# EasyEDA Pro project BLDCV6-nerdyintern.eprj, board PCB3
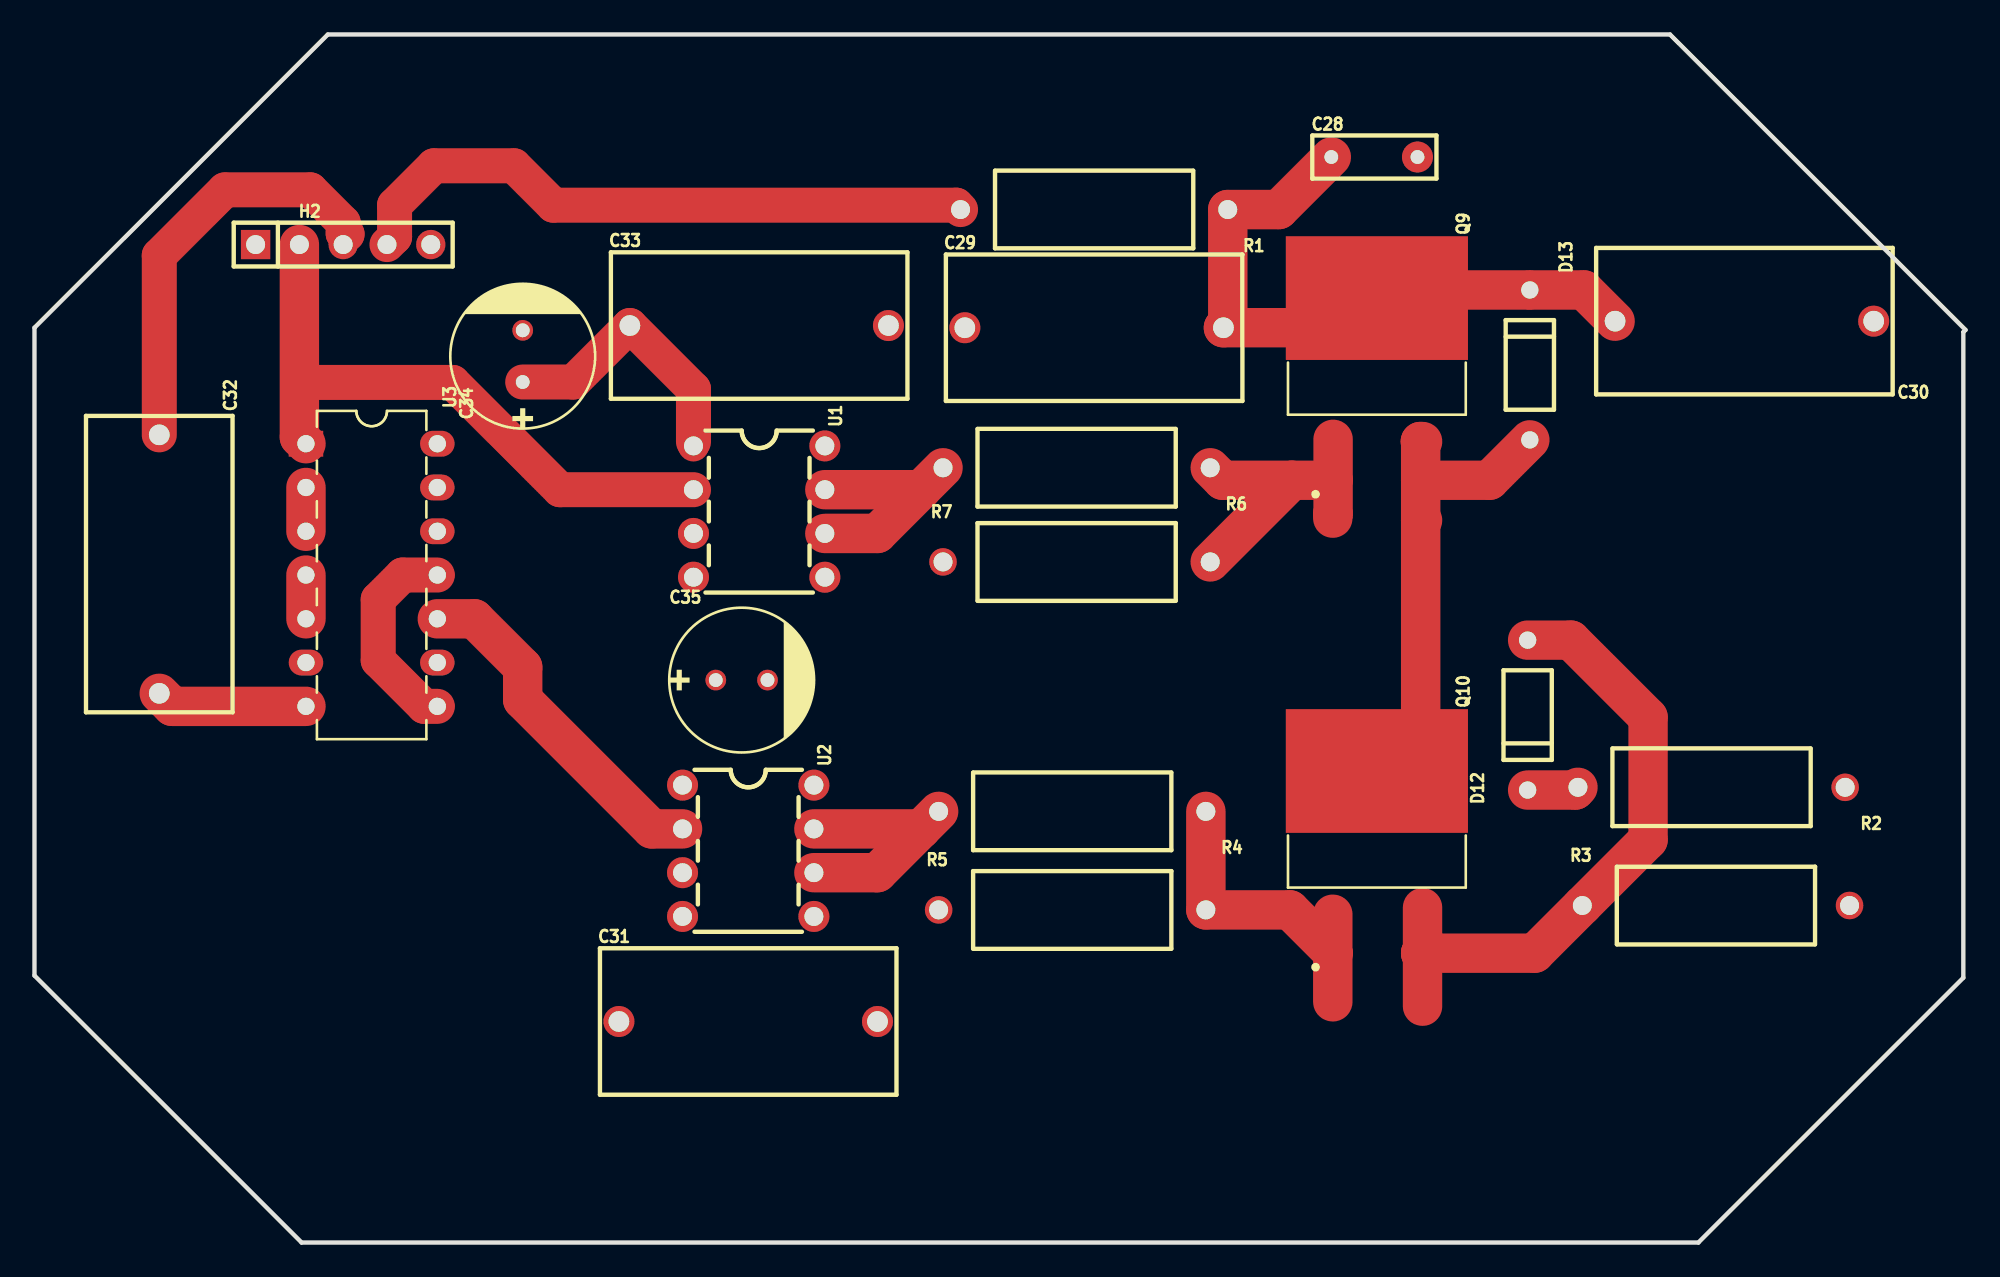
[diagram p9: board, top side]
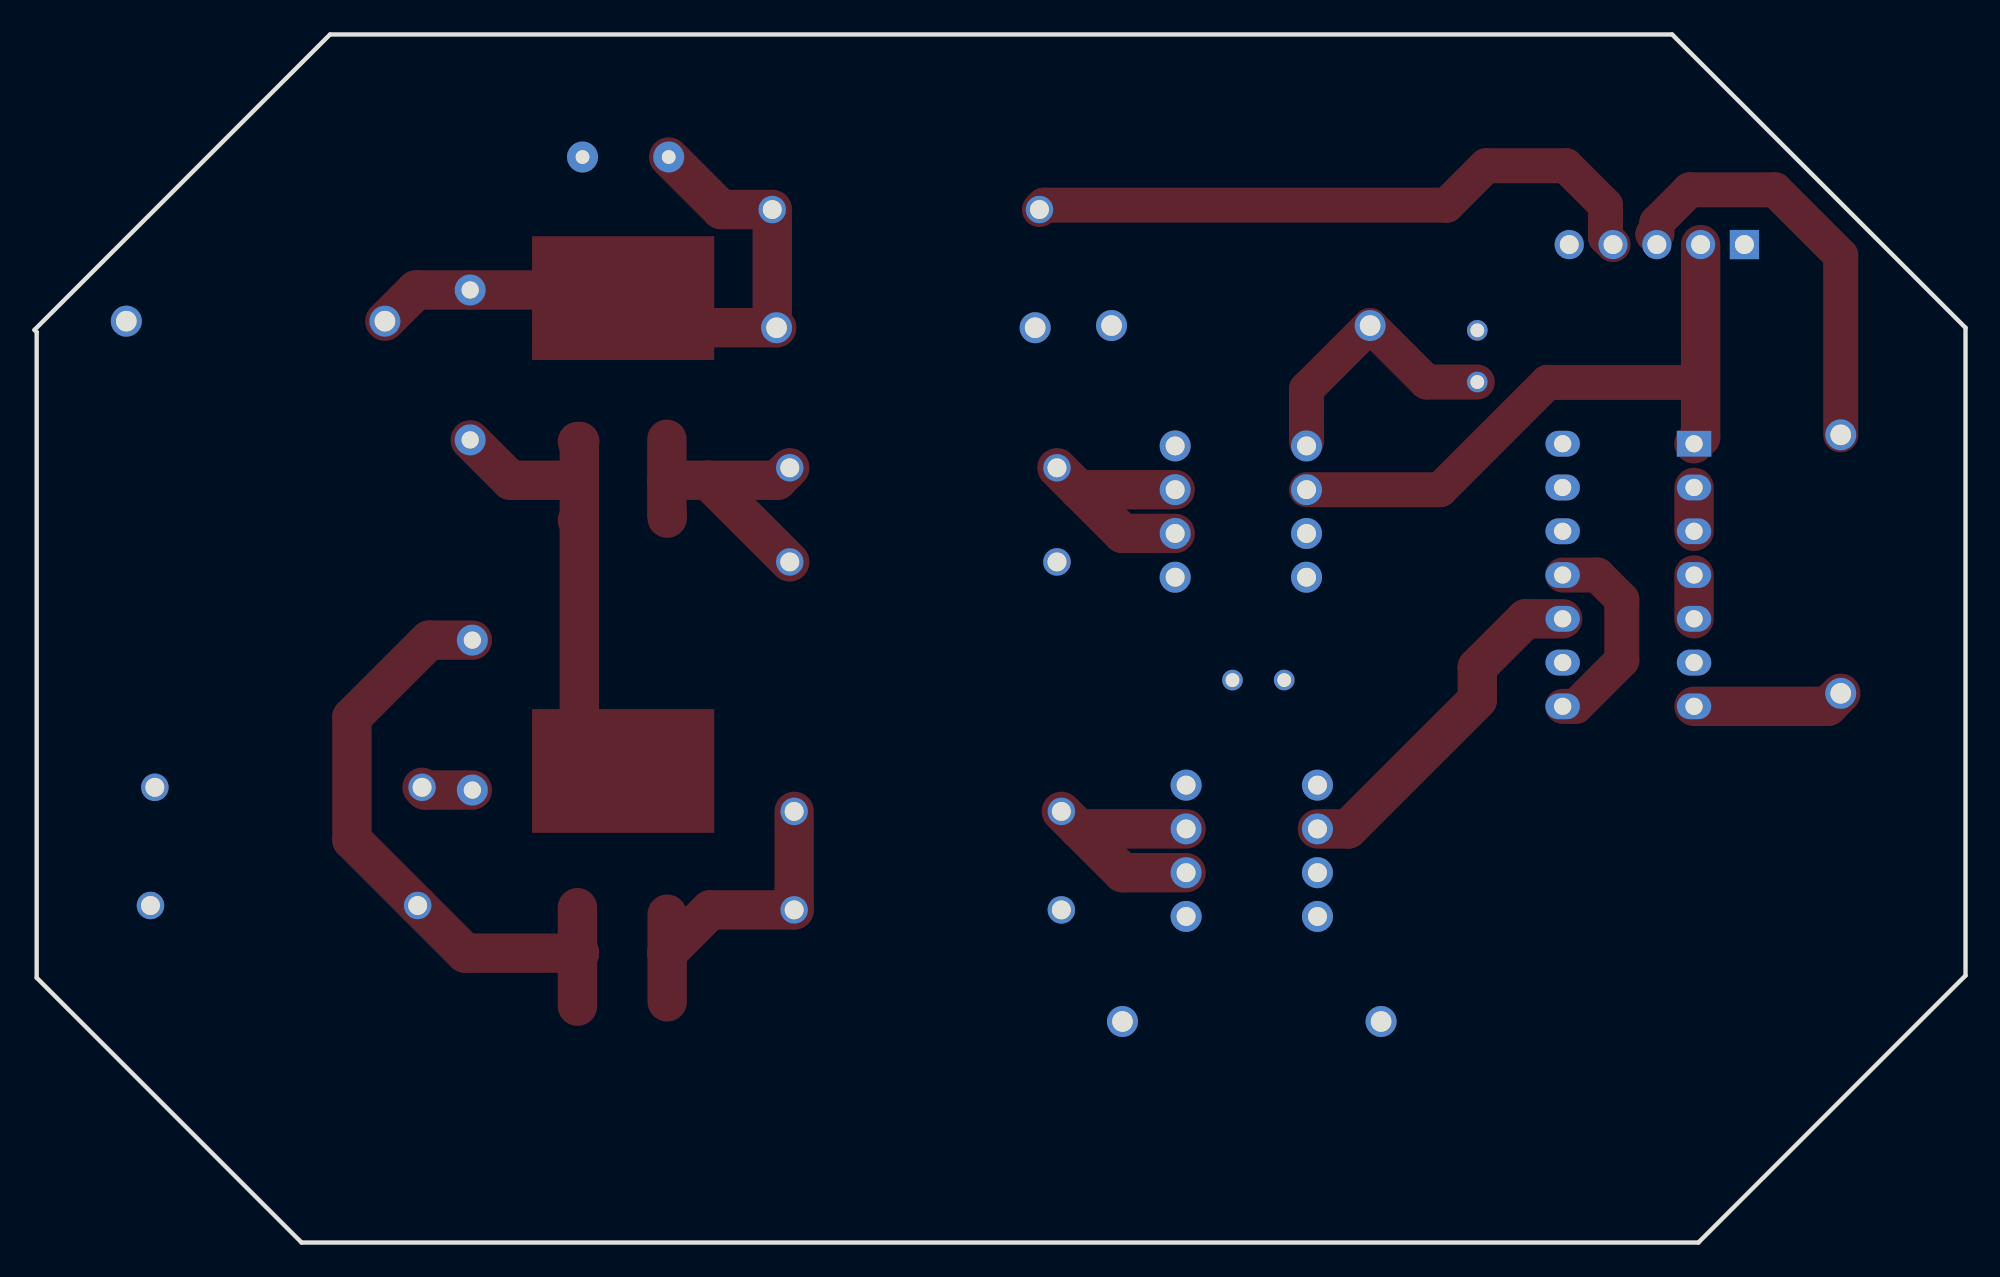
[diagram p10: board, bottom side, seen from below]

Outline 112.01 x 70.1 mm; copper layers: Top Layer, Bottom Layer. Coordinates in mm from the lower left corner of the outline.
Outline path: 0,53.09 0,15.49 15.49,0 96.52,0 111.89,15.37 111.89,52.83 112.01,52.96 94.87,70.1 17.02,70.1 0,53.09
Stack: Top Layer 0.035mm / Dielectric1 1.51mm FR4 er 4.5 / Bottom Layer 0.035mm

## Design rules (mm)
template: Custom Config
spacing copperThickness1oz (default): track to track 0.75, other pairs 0.152 to 0.3
spacing copperThickness2oz: track to track 0.203, other pairs 0.152 to 0.3
track width copperThickness1oz (default): min 0.127, default 0.254, max 2.54
track width copperThickness2oz: min 0.203, default 0.254, max 2.54
differential pair differentialPair (default): width min 0.127, default 0.254, max 2.54; gap min 0.152, default 0.152
via viaSize (default): diameter min 0.5, default 0.61, max 10; hole min 0.3, default 0.305, max 6.3

## Placement (name value [footprint] x y rotation side)
C28  1uF  [CAP-TH_L7.2-W2.5-P5.00-D0.6]  77.72 62.99 0 top
C29  1uF  [CAP-TH_L17.0-W8.5-P15.00-D0.8]  61.47 53.09 0 top
C30  1uF  [CAP-TH_L17.0-W8.5-P15.00-D0.8]  99.19 53.47 180 top
C31  1uF  [CAP-TH_L17.0-W8.5-P15.00-D0.8]  41.4 12.83 0 top
C32  1uF  [CAP-TH_L17.0-W8.5-P15.00-D0.8]  7.24 39.37 270 top
C33  1uF  [CAP-TH_L17.0-W8.5-P15.00-D0.8]  42.04 53.21 0 top
C34  15uF 450V  [CAP-TH_BD8.3-P3.00-D0.6-FD]  28.32 51.43 90 top
C35  15uF 450V  [CAP-TH_BD8.3-P3.00-D0.6-FD]  41.02 32.64 0 top
D12  -  [DO-41_BD2.4-L4.7-P8.70-D0.9-RD]  86.61 30.61 90 top
D13  -  [DO-41_BD2.4-L4.7-P8.70-D0.9-RD]  86.74 50.93 270 top
H2  -  [HDR-TH_5P-P2.54-V-M]  17.91 57.91 0 top
Q9  IRFS4010TRLPBF  [D2PAK_L9.1-W10.0-P2.54-LS15.3-BR-1]  77.87 49.52 270 top
Q10  IRFS4010TRLPBF  [D2PAK_L9.1-W10.0-P2.54-LS15.3-BR-1]  77.87 22.08 270 top
R1  10kΩ  [RES-TH_BD4.5-L11.5-P15.50-D0.8]  61.47 59.94 180 top
R2  10kΩ  [RES-TH_BD4.5-L11.5-P15.50-D0.8]  97.28 26.42 180 top
R3  10kΩ  [RES-TH_BD4.5-L11.5-P15.50-D0.8]  97.54 19.56 0 top
R4  10kΩ  [RES-TH_BD4.5-L11.5-P15.50-D0.8]  60.2 25.02 180 top
R5  10kΩ  [RES-TH_BD4.5-L11.5-P15.50-D0.8]  60.2 19.3 0 top
R6  10kΩ  [RES-TH_BD4.5-L11.5-P15.50-D0.8]  60.45 44.96 180 top
R7  10kΩ  [RES-TH_BD4.5-L11.5-P15.50-D0.8]  60.45 39.5 0 top
U1  TC4420EPA  [PDIP-8_L9.3-W6.4-P2.54-LS7.6-BL]  42.04 42.42 270 top
U2  TC4420EPA  [PDIP-8_L9.3-W6.4-P2.54-LS7.6-BL]  41.4 22.73 270 top
U3  SN74HC14N(XBLW)  [DIP-14_L19.0-W6.4-P2.54-LS7.6-BL]  19.56 38.73 270 top

## Footprints (pads in the part's own frame, mm; a bottom-side part is the same pattern mirrored in y, then rotated)
CAP-TH_BD8.3-P3.00-D0.6-FD
  round 1.202 hole 0.801: 1(-1.5,0) 2(1.5,0)
CAP-TH_L7.2-W2.5-P5.00-D0.6
  round 1.8 hole 0.8: 1(-2.499,0) 2(2.499,0)
CAP-TH_L17.0-W8.5-P15.00-D0.8
  round 1.8 hole 1.2: 1(-7.5,0) 2(7.5,0)
D2PAK_L9.1-W10.0-P2.54-LS15.3-BR-1
  rect 3.358x1.134 smd: 1(5.285,-2.54) 3(5.285,2.54)
  rect 7.181x10.566 smd: 4(-5.286,0)
DIP-14_L19.0-W6.4-P2.54-LS7.6-BL
  rect 1.5x2 hole 1: 1(-7.62,-3.81)
  oval 1.5x2 hole 1: 2(-5.08,-3.81) 3(-2.54,-3.81) 4(0,-3.81) 5(2.54,-3.81) 6(5.08,-3.81) 7(7.62,-3.81) 8(7.62,3.81) 9(5.08,3.81) 10(2.54,3.81) 11(0,3.81) 12(-2.54,3.81) 13(-5.08,3.81) 14(-7.62,3.81)
DO-41_BD2.4-L4.7-P8.70-D0.9-RD
  round 1.8 hole 1: 1(-4.35,0) 2(4.35,0)
HDR-TH_5P-P2.54-V-M
  rect 1.7x1.7 hole 1.1: 1(-5.08,0)
  round 1.7 hole 1.1: 2(-2.54,0) 3(0,0) 4(2.54,0) 5(5.08,0)
PDIP-8_L9.3-W6.4-P2.54-LS7.6-BL
  round 1.8 hole 1.1: 1(-3.81,-3.81) 2(-1.27,-3.81) 3(1.27,-3.81) 4(3.81,-3.81) 5(3.81,3.81) 6(1.27,3.81) 7(-1.27,3.81) 8(-3.81,3.81)
RES-TH_BD4.5-L11.5-P15.50-D0.8
  round 1.6 hole 1.1: 1(-7.75,0) 2(7.75,0)

## Nets
As in the schematic.

Pads without a net: U1 3; U2 3; U3 12

## Routing (per net, layer and track width the routed paths; a pad name or vN(x,y) marks a point on that pad's centre or on a via; arc(x,y) is an arc through that point)
+5V: length 24.3
  Top Layer w2.032: C32.1 7.24,57.28 11.05,61.09 16,61.09 17.91,59.18 17.91,58.55 18.13,58.52 18.14,58.51
GND: length 8.8
  Top Layer w2.286: C32.2 7.99,31.11 U3.7
VCC: length 37.3
  Top Layer w2.032: R1.2 53.46,60.2 30.1,60.2 27.81,62.48 23.17,62.48 20.89,60.2 20.89,58.35 H2.4
VCC_DRV: length 15.8
  Top Layer w2.032: C34.1 31.26,49.93 C33.1 38.23,49.52 38.23,46.47
HIN: length 37.1
  Top Layer w2.032: U1.2 30.48,43.69 24.26,49.91 16,49.91 15.62,49.53
  Top Layer w2.286: 15.37,57.91 15.37,46.74 U3.1
HOUT: length 14
  Top Layer w2.286: U1.6 48.89,41.15 51.43,43.69 ; U1.7 51.43,43.69 ; 51.43,43.69 R6.2
HSGATE: length 18.7
  Top Layer w2.286: Q9.1 75.33,42.29 75.31,42.29 75.31,42.04 ; Q9.1 75.33,46.61 ; Q9.1 72.94,44.23 ; R6.1 68.93,44.23 72.94,44.23 ; R7.2 72.94,44.23
HSS: length 38.6
  Top Layer w2.286: C30.2 89.88,55.28 D13.1 78.34,55.28 Q9.4 76.15,53.09 C29.2 69.22,53.34 R1.1 72.18,59.94 C28.1
LIN: length 20.4
  Top Layer w2.286: U3.10 25.51,36.19 28.32,33.38 28.32,31.5 35.81,24 37.59,24
LOUT: length 14.9
  Top Layer w2.286: 51.43,24 R4.2 ; 51.43,24 45.21,24 ; 51.43,24 48.89,21.46 U2.6
LSD: length 37.7
  Top Layer w2.286: 80.52,19.43 80.52,16.9 Q10.3 ; Q10.3 87.02,16.79 R3.1 93.6,23.37 93.6,30.48 89.12,34.96 D12.2 ; Q10.3 80.52,16.68 80.52,13.72
LSGATE: length 19.2
  Top Layer w2.286: R4.1 R5.2 72.82,19.3 75.31,16.81 ; 75.31,19.05 75.31,16.81 ; 75.31,16.81 Q10.1 75.31,16.77 75.31,13.97
SWITCH_NODE: length 30.7
  Top Layer w2.286: D13.2 84.4,44.23 Q9.3 ; Q10.4 80.41,29.9 80.41,41.91 ; 80.41,41.91 Q9.3 ; 80.41,41.91 80.52,41.91 ; Q9.3 80.41,46.46 80.39,46.48 80.52,46.48 ; R2.2 89.37,26.26 86.61,26.26
$1N1254: length 2.5
  Top Layer w2.286: U3.2 U3.3
$1N1258: length 2.5
  Top Layer w2.286: U3.4 U3.5
$1N1264: length 12.1
  Top Layer w2.032: U3.11 21.35,38.73 19.94,37.32 19.94,33.78 22.61,31.11 U3.8
